# EAGLE design giraffevolvo (EAGLE 9.5.0)
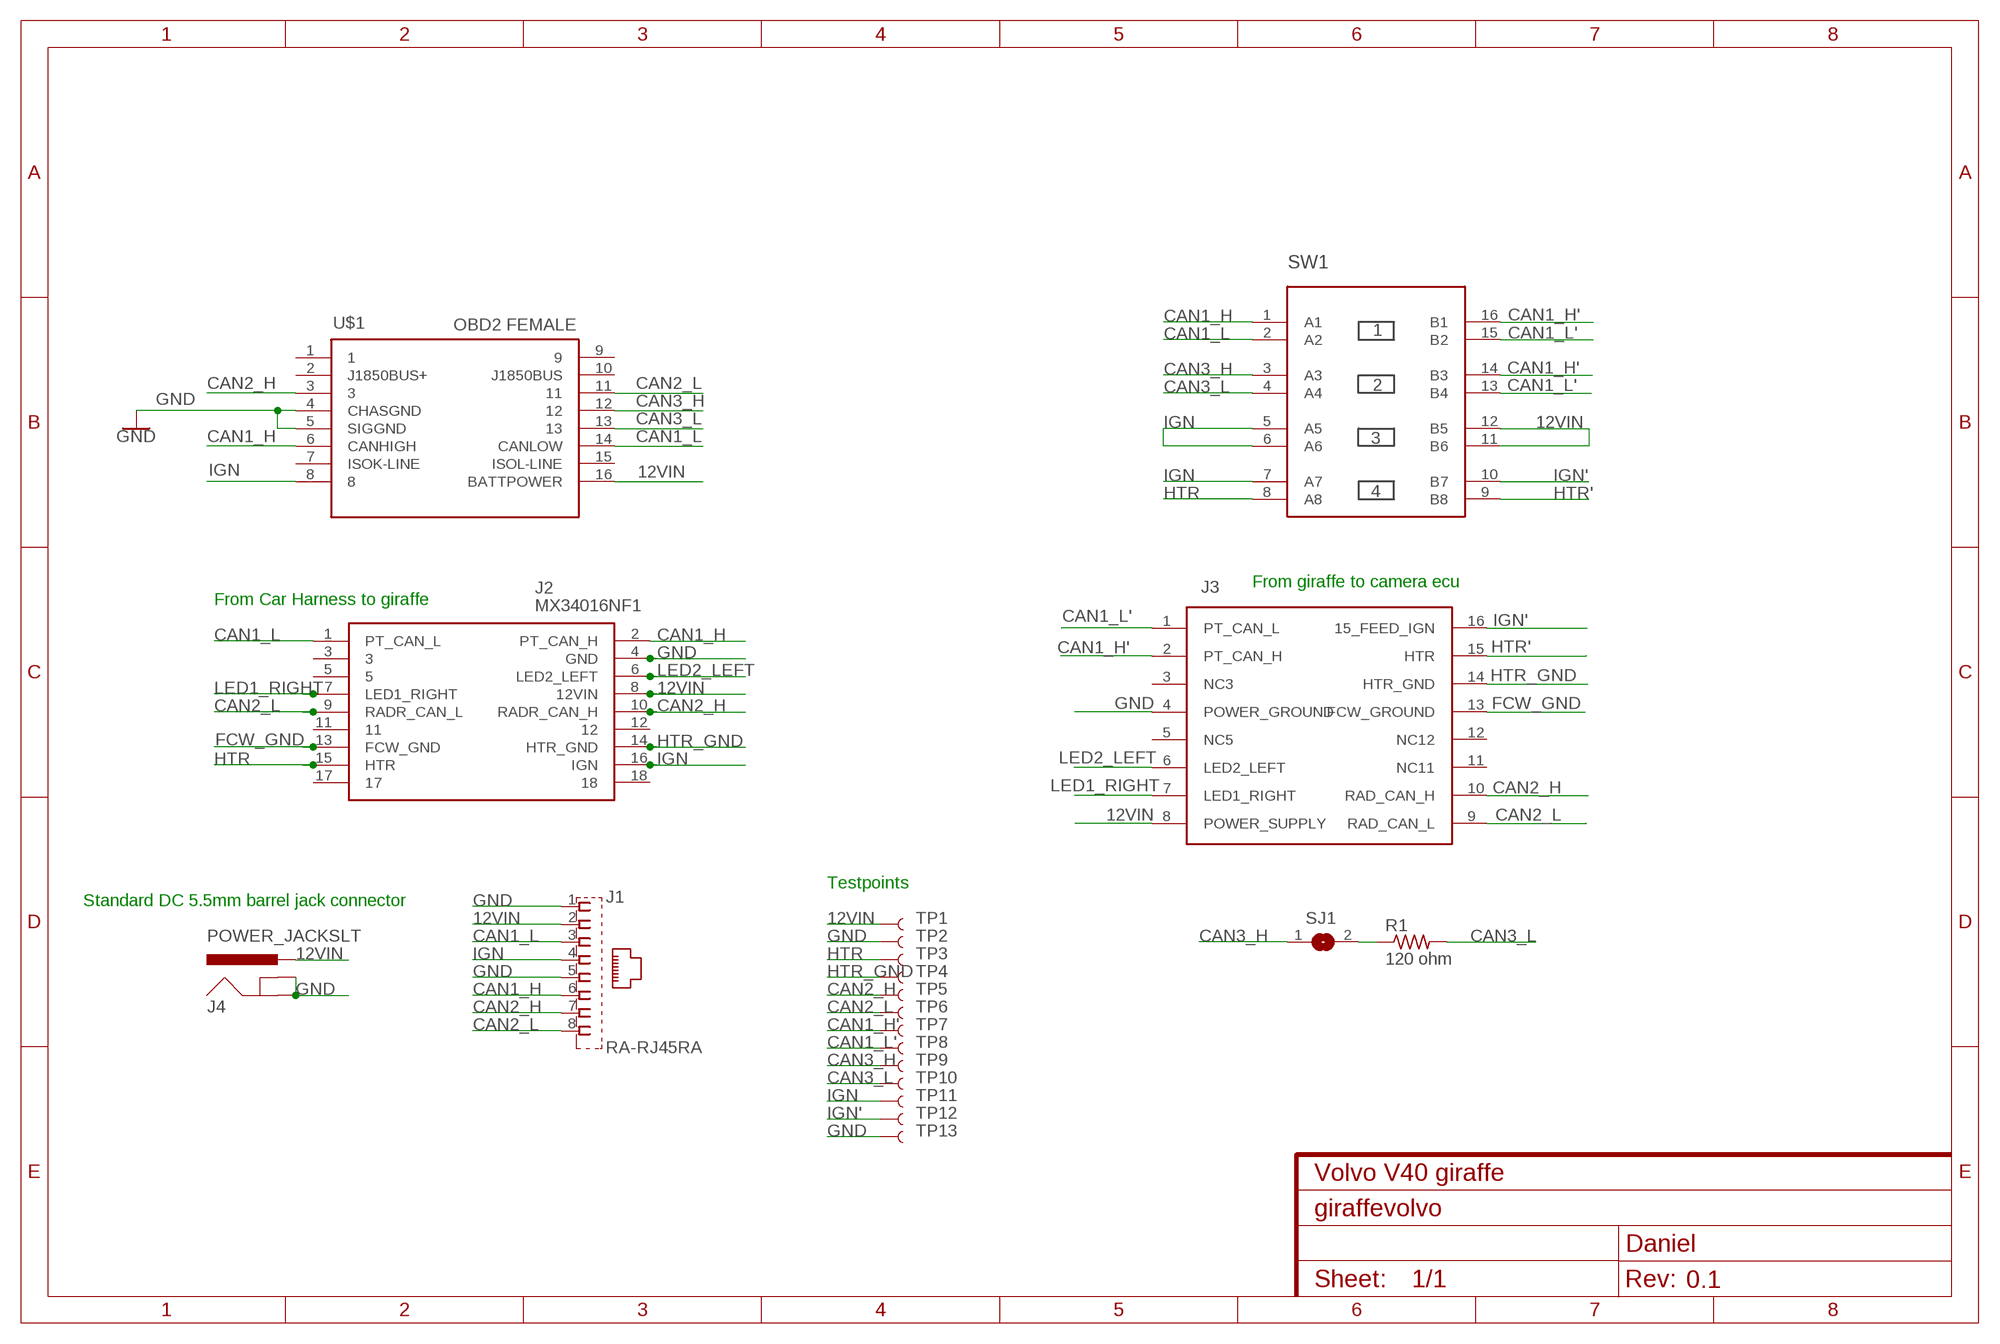
[diagram p0: schematic, sheet 1]
FRAME1 (FRAME-A4L): CNAME: Volvo V40 giraffe; CREVISION: 0.1; DESIGNER: Daniel

## Parts
J1  RA-RJ45RA  [RA-RJ45]
J2  MX34016NF1  [MX34016NF1]
J3  MX34016SF1  [MX34016SF1]
J4  POWER_JACKSLT  [POWER_JACK_SLOT]
R1  120 ohm  R0603  [0603-R]
SJ1  SJ  [SJ]
SW1  4XDPSTSMT  [4-DPST]
TP1  TEST-POINT2  [PAD.02X.02]
TP2  TEST-POINT2  [PAD.02X.02]
TP3  TEST-POINT2  [PAD.02X.02]
TP4  TEST-POINT2  [PAD.02X.02]
TP5  TEST-POINT2  [PAD.02X.02]
TP6  TEST-POINT2  [PAD.02X.02]
TP7  TEST-POINT2  [PAD.02X.02]
TP8  TEST-POINT2  [PAD.02X.02]
TP9  TEST-POINT2  [PAD.02X.02]
TP10  TEST-POINT2  [PAD.02X.02]
TP11  TEST-POINT2  [PAD.02X.02]
TP12  TEST-POINT2  [PAD.02X.02]
TP13  TEST-POINT2  [PAD.02X.02]
U$1  OBDIIFEMALE  [OBDII-FEMALE]

## Nets
12VIN: J1.2 J2.8(12VIN) J3.8(POWER_SUPPLY) J4.PWR SW1.11(B6) SW1.12(B5) TP1.P$1 U$1.16(BATTPOWER)
CAN1_H [can]: J1.6 J2.2(PT_CAN_H) SW1.1(A1) U$1.6(CANHIGH)
CAN1_H' [can]: J3.2(PT_CAN_H) SW1.14(B3) SW1.16(B1) TP7.P$1
CAN1_L [can]: J1.3 J2.1(PT_CAN_L) SW1.2(A2) U$1.14(CANLOW)
CAN1_L' [can]: J3.1(PT_CAN_L) SW1.13(B4) SW1.15(B2) TP8.P$1
CAN2_H [can]: J1.7 J2.10(RADR_CAN_H) J3.10(RAD_CAN_H) TP5.P$1 U$1.3
CAN2_L [can]: J1.8 J2.9(RADR_CAN_L) J3.9(RAD_CAN_L) TP6.P$1 U$1.11
CAN3_H [can]: SJ1.1 SW1.3(A3) TP9.P$1 U$1.12
CAN3_L [can]: R1.2 SW1.4(A4) TP10.P$1 U$1.13
FCW_GND [led]: J2.13(FCW_GND) J3.13(FCW_GROUND)
GND: J1.1 J1.5 J2.4(GND) J3.4(POWER_GROUND) J4.GND@1(GNDBREAK) J4.GND@2(GND) TP2.P$1 TP13.P$1 U$1.4(CHASGND) U$1.5(SIGGND)
HTR: J2.15(HTR) SW1.8(A8) TP3.P$1
HTR': J3.15(HTR) SW1.9(B8)
HTR_GND [led]: J2.14(HTR_GND) J3.14(HTR_GND) TP4.P$1
IGN [can]: J1.4 J2.16(IGN) SW1.5(A5) SW1.6(A6) SW1.7(A7) TP11.P$1 U$1.8
IGN' [can]: J3.16(15_FEED_IGN) SW1.10(B7) TP12.P$1
LED1_RIGHT [led]: J2.7(LED1_RIGHT) J3.7(LED1_RIGHT)
LED2_LEFT [led]: J2.6(LED2_LEFT) J3.6(LED2_LEFT)
N$1 [can]: R1.1 SJ1.2
Unconnected: J2.3 J2.5 J2.11 J2.12 J2.17 J2.18 J3.3(NC3) J3.5(NC5) J3.11(NC11) J3.12(NC12) U$1.1 U$1.2(J1850BUS+) U$1.7(ISOK-LINE) U$1.9 U$1.10(J1850BUS) U$1.15(ISOL-LINE)

## Notes on the sheet
- From giraffe to camera ecu
- From Car Harness to giraffe
- Testpoints
- Standard DC 5.5mm barrel jack connector

## Library data of the parts
J1 = comma.ai:RA-RJ45
J2 = MX34016NF1:MX34016NF1: JAE MX34 Series, 2.2mm Pitch 16 Way 2 Row Right Angle PCB Header, Solder Termination, 3A Source: Datasheet <https://componentsearchengine.com/Datasheets/1/MX34016NF1.pdf>; DESCRIPTION: JAE MX34 Series, 2.2mm Pitch 16 Way 2 Row Right Angle PCB Header, Solder Termination, 3A; HEIGHT: 16mm; MANUFACTURER_NAME: JAE Electronics; MANUFACTURER_PART_NUMBER: MX34016NF1; MOUSER_PART_NUMBER: 656-MX34016NF1; MOUSER_PRICE-STOCK: https://www.mouser.com/Search/Refine.aspx?Keyword=656-MX34016NF1
J3 = MX34016SF1:MX34016SF1: 16-pin female autmotive connector.
J4 = SparkFun-Connectors:POWER_JACK: Power Jack Connector This is the standard 5.5mm barrel jack for power. The PTH is the most common, proven, reliable, footprint. The Slot footprint only works if the mill layer is transmitted to the PCB fab house so be warned. Here are the connectors we sell at SparkFun: DC Barrel Power Jack/Connector <https://www.sparkfun.com/products/119> (PRT-00119) DC Barrel Power Jack/Connector (SMD) <https://www.sparkfun.com/products/12748> (PRT-12748) DC Barrel Jack Adapter - Breadboard Compatible <https://www.sparkfun.com/products/10811> (PRT-10811) It is used on this SparkFun product (and many, many others): SparkFun RedBoard - Programmed with Arduino <https://www.sparkfun.com/products/12757> (DEV-12757) Also, if you need a mating power supply or connector, please check these out: Wall Adapter Power Supply - 9VDC 650mA <https://www.sparkfun.com/products/298> (TOL-00298) DC Barrel Jack Adapter - Male <https://www.sparkfun.com/products/10287> (PRT-10287); PROD_ID: PRT-00119
R1 = comma.ai:R
SJ1 = jumper:SJ: SMD solder JUMPER
SW1 = comma.ai:4XDPST
TP1-TP13 = SparkFun-Connectors:TEST-POINT: SparkFun Test Points Bare copper test points for troubleshooting or In-Circuit-Testing. These are used by our Production team for verifying production board runs using pogo-pins on test beds. SparkFun Products: SparkFun LSM9DS1 Breakout <https://www.sparkfun.com/products/13284> SparkFun PSOC <https://www.sparkfun.com/products/13714> SparkFun Load Cell Amplifier <https://www.sparkfun.com/products/13879>
U$1 = comma.ai:OBDII: OBDII connector footprint; TEXT: OBD2 FEMALE

## Net classes
0 pwr: width 2 mm, drill 0.6 mm, clearance 0.2 mm
1 can: width 0.3 mm, drill 0.3 mm, clearance 0.16 mm
2 led: width 0.6 mm, drill 0.3 mm, clearance 0.2 mm

## Board
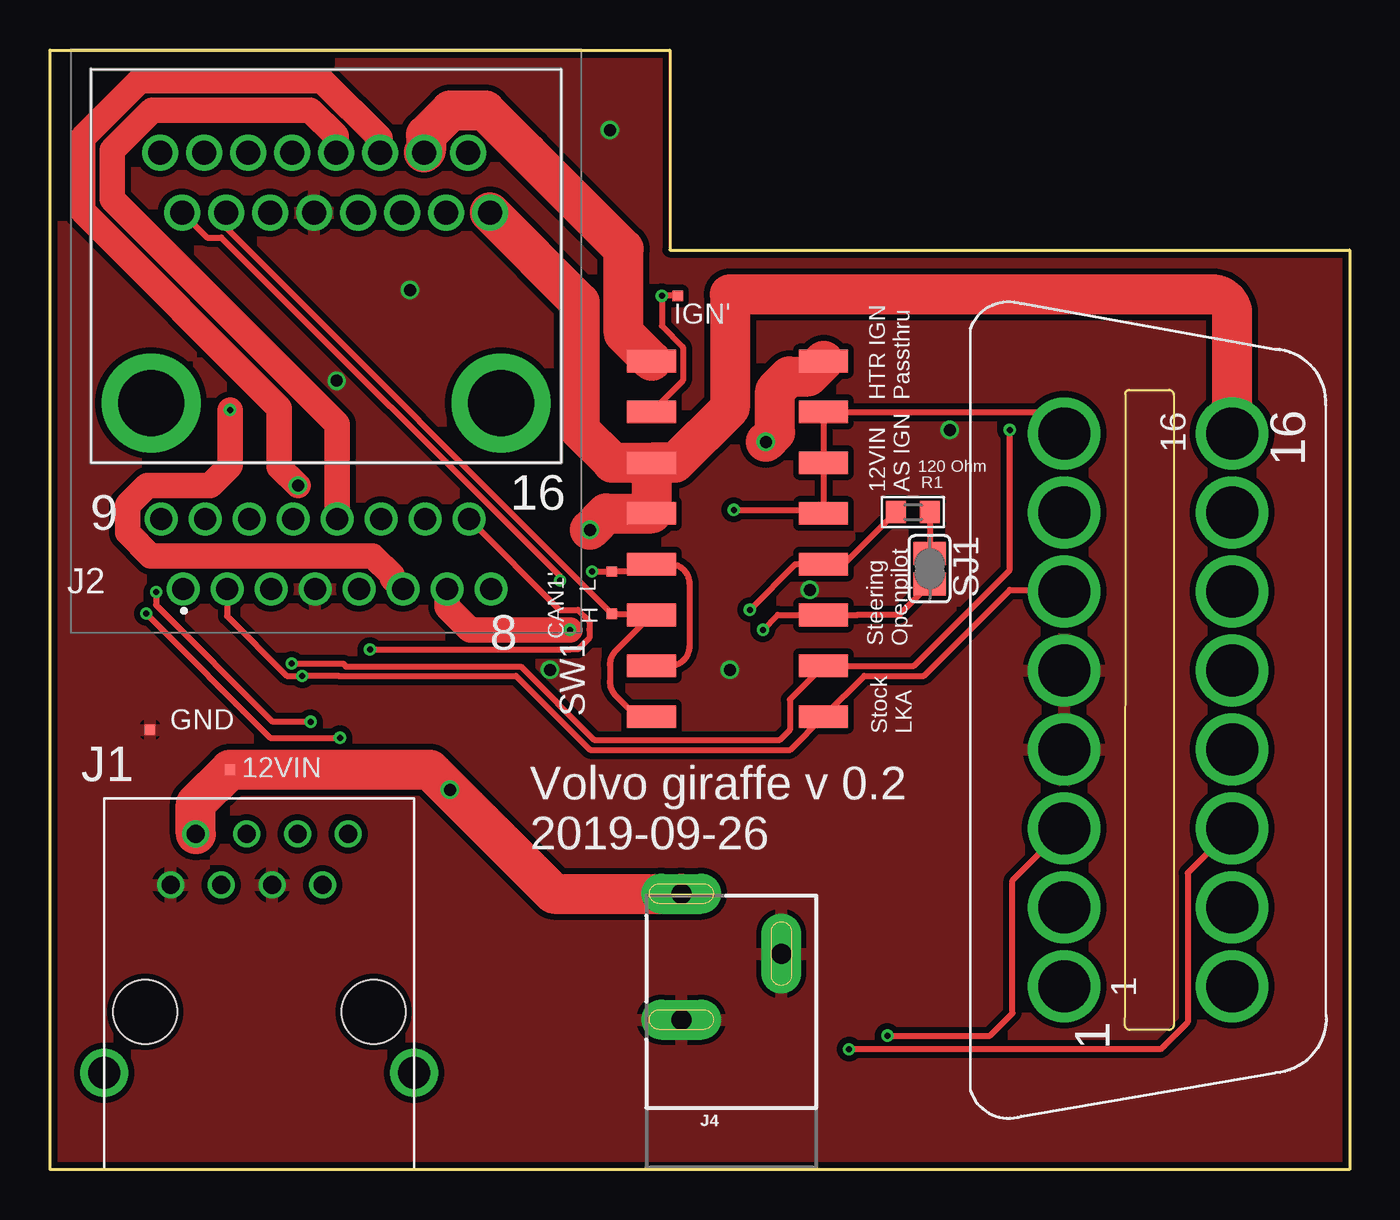
[diagram p1: board, top side]
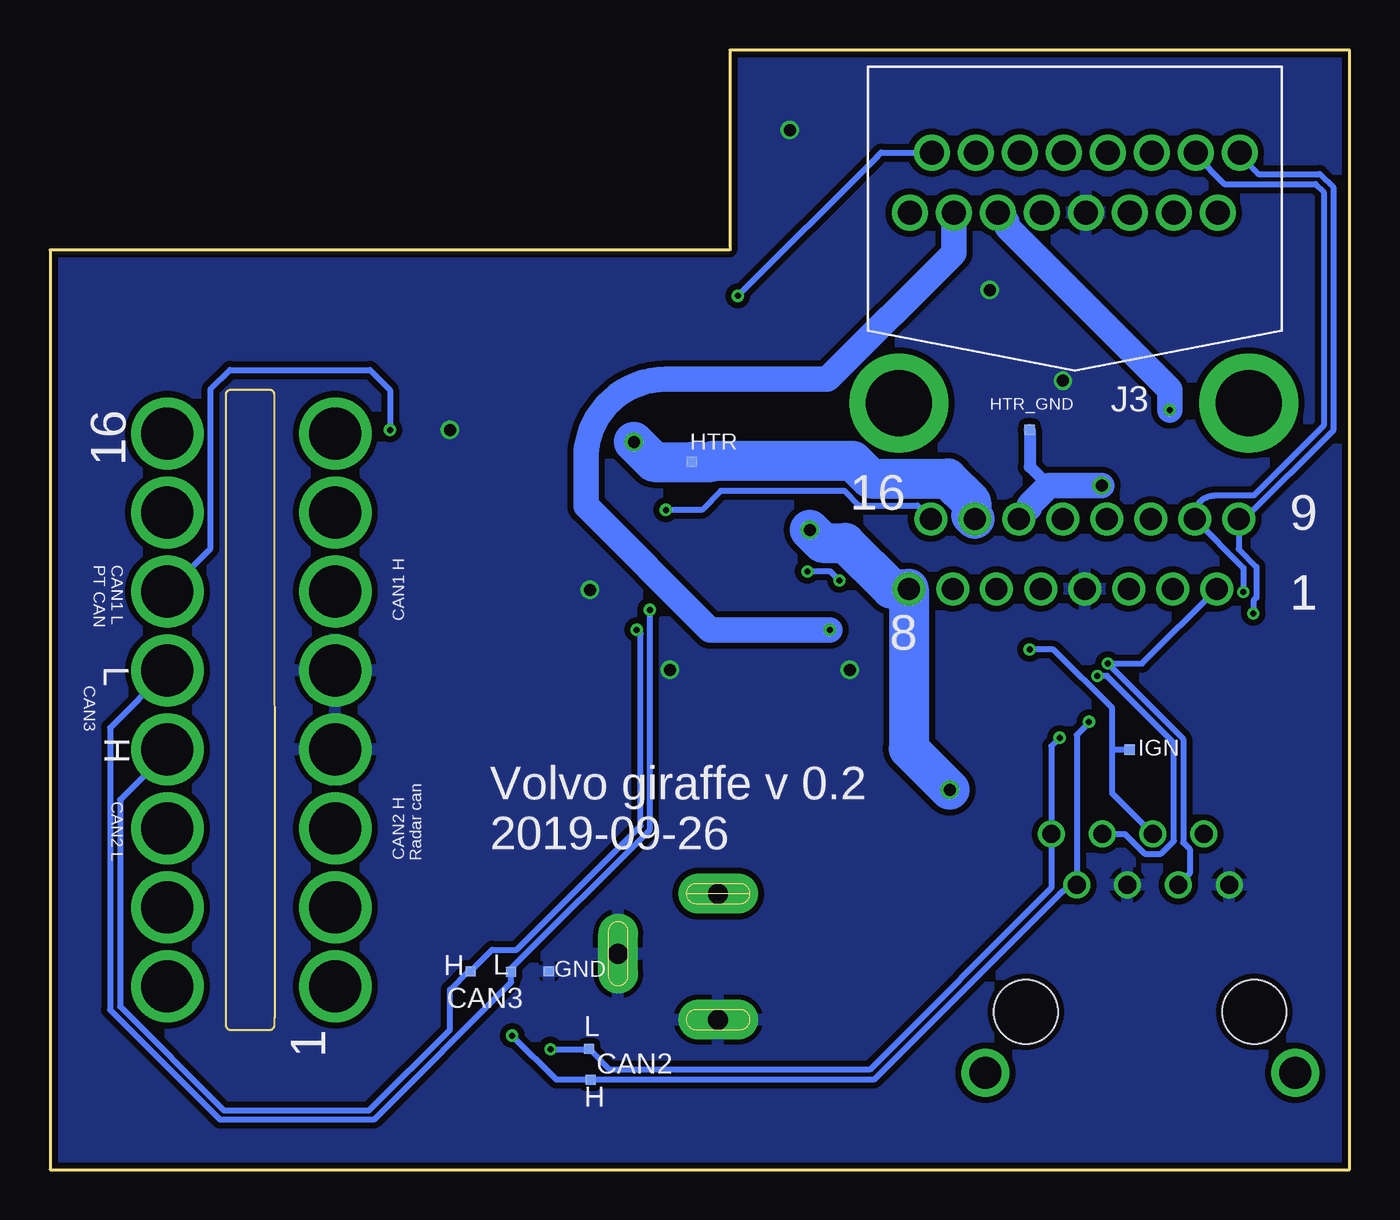
[diagram p2: board, bottom side, seen from below]

Size 65 x 56 mm. Coordinates in mm from the lower left corner, seen from the top.
Outline: 0,0 0,56 31,56 31,46 65,46 65,0 0,0
Copper layers (1*16): Top 0.035mm / dielectric 1.5mm / Bottom 0.035mm
Design rules "SparkFun-2-layer-PCBWay-LIMIT": minimum track width 6mil, minimum drill 0.3mm, track to track 6mil, track to pad 6mil, pad to pad 6mil, via to via 6mil, smd to smd 6mil, copper to edge 6mil, drill to drill 6mil, minimum pad ring 6mil, minimum via ring 6mil, stop-mask expansion 4mil, vias tented up to drill 25mil, thermal gap 10mil
Milling: 10 lines

### Footprints (pad centres in the part's own frame; a part is rotated, then mirrored left to right if it is on the bottom)
RA-RJ45 = drill 0.9: 1 -4.445,6.35; 2 -3.175,8.89; 3 -1.905,6.35; 4 -0.635,8.89; 5 0.635,6.35; 6 1.905,8.89; 7 3.175,6.35; 8 4.445,8.89 | drill 1.6: P$1 -7.75,-3.05; P$2 7.75,-3.05 | hole 3.2: -5.715,0; 5.715,0
MX34016NF1 = drill 1.1 pad 1.65: 1 7.15,12.4; 2 4.95,12.4; 3 2.75,12.4; 4 0.55,12.4; 5 -1.65,12.4; 6 -3.85,12.4; 7 -6.05,12.4; 8 -8.25,12.4; 9 8.25,8.9; 10 6.05,8.9; 11 3.85,8.9; 12 1.65,8.9; 13 -0.55,8.9; 14 -2.75,8.9; 15 -4.95,8.9; 16 -7.15,8.9 | drill 3.3 pad 4.95: 17 -8.75,3.1; 18 8.75,3.1
MX34016SF1 = drill 1.2: 1 -7.15,6.1; 2 -4.95,6.1; 3 -2.75,6.1; 4 -0.55,6.1; 5 1.65,6.1; 6 3.85,6.1; 7 6.05,6.1; 8 8.25,6.1; 9 -8.25,3.1; 10 -6.05,3.1; 11 -3.85,3.1; 12 -1.65,3.1; 13 0.55,3.1; 14 2.75,3.1; 15 4.95,3.1; 16 7.15,3.1
POWER_JACK_SLOT = drill 1 pad 2 long: GND@1 2.58,7.5; GND@2 7.58,10.8; PWR 2.58,13.8
0603-R = smd 1 x 1.1: 1 -0.85,0; 2 0.85,0
SJ = smd 1.168 x 1.6: 1 -0.762,0; 2 0.762,0
4-DPST = smd 1.13 x 2.44: 1 -8.89,-4.3; 2 -6.35,-4.3; 3 -3.81,-4.3; 4 -1.27,-4.3; 5 1.27,-4.3; 6 3.81,-4.3; 7 6.35,-4.3; 8 8.89,-4.3; 9 8.89,4.3; 10 6.35,4.3; 11 3.81,4.3; 12 1.27,4.3; 13 -1.27,4.3; 14 -3.81,4.3; 15 -6.35,4.3; 16 -8.89,4.3
PAD.02X.02 = smd 0.508 x 0.508: P$1 0,0
OBDII-FEMALE = drill 2.6 pad 3.4: 1 13.825,-4.2; 2 9.875,-4.2; 3 5.925,-4.2; 4 1.975,-4.2; 5 -1.975,-4.2; 6 -5.925,-4.2; 7 -9.875,-4.2; 8 -13.825,-4.2; 9 13.825,4.2; 10 9.875,4.2; 11 5.925,4.2; 12 1.975,4.2; 13 -1.975,4.2; 14 -5.925,4.2; 15 -9.875,4.2; 16 -13.825,4.2

### Placement (x,y rotation side)
J1  10.47,7.89 0 top
J2  13.8,41.44 180 top
J3  13.75,53.97 180 bottom
J4  29,0 0 top
R1  43.17,32.88 180 top
SJ1  44,30.05 90 top
SW1  34.39,31.55 90 top
TP1  9,20 0 top
TP2  40.05,9.91 0 bottom
TP3  32.9,35.4 0 bottom
TP4  16,37 0 bottom
TP5  37.97,4.49 0 bottom
TP6  38.04,6.03 0 bottom
TP7  28.1,27.8 0 top
TP8  28.1,29.91 0 top
TP9  43.96,9.92 0 bottom
TP10  41.93,9.88 0 bottom
TP11  11,21 0 bottom
TP12  31.4,43.7 0 top
TP13  5,22 0 top
U$1  54.93,22.99 270 top

### Tracks (layer width: path | path; a pad name or v marks a point on that pad's centre or on a via)
12VIN  (via drill 0.6)
  Top 2: SW1.11 28.14,35.36 26.5,37 26.5,43.38 J3.8 | SW1.11 31.26,35.36 34,38.1 34,43.77 58.13,43.77 arc-90 59.13,42.77 U$1.16 | J1.2 7.29,18.3 TP1.P$1 19,20 v20,19 25.2,13.8 J4.PWR | SW1.11 SW1.12 27.82,32.82 v27,32
  Bottom 2: v27,32 26.35,31.35 25.23,31.35 22.91,29.04 J2.8 22.05,21.05 v20,19
CAN1_H  (via drill 0.3)
  Top 0.3: U$1.6 50.65,29 48,29 43.7,24.7 40.73,24.7 SW1.1 37.03,21 27,21 23.3,24.7 14.42,24.7 14.41,24.69 v12.62,24.69 11.84,24.69 8.85,27.68 J2.2
  Bottom 0.3: J1.6 11.23,16.78 10.24,15.79 9.43,15.79 8.78,16.44 8.78,21.34 12.13,24.69 v12.62,24.69
CAN1_H'
  Top 0.3: J3.2 8.8,47.1 TP7.P$1 30.03,27.8 SW1.14 28.29,25.94 arc45 28,25.24 28,24.41 arc45 28.29,23.71 29.05,22.95 arc45 29.75,22.66 SW1.16
CAN1_L  (via drill 0.3)
  Top 0.3: v48,37 48,30 43.2,25.2 SW1.2 37,23.51 37,22 36.5,21.5 27.22,21.5 23.56,25.16 14.81,25.16 14.66,25.3 v12.1,25.3
  Bottom 0.3: U$1.14 56.97,31.07 56.97,39.03 56,40 49,40 48,39 v48,37 | J1.3 8,14.8 8,16.04 8.32,16.36 8.32,21.53 v12.1,25.3 10.39,25.3 J2.1
CAN1_L'  (via drill 0.3)
  Top 0.3: J3.1 7.85,46.62 8.57,46.62 25.51,29.68 v25.51,29.46 | SW1.15 31,25.2 arc90 32,26.2 32,29.28 arc90 31,30.28 SW1.13 29.72,29.91 TP8.P$1 27.14,29.9 v27.12,29.92
  Bottom 0.3: v25.51,29.46 25.97,29.92 v27.12,29.92
CAN2_H  (via drill 0.3)
  Top 0.3: v5.3,28.88 5.3,28.24 11.15,22.4 v13.03,22.4 | v41.88,6.7 47.02,6.7 48.14,7.82 48.14,14.47 U$1.3
  Bottom 0.3: v13.03,22.4 13.03,22.35 13.64,21.73 J1.7 13.8,14.08 arc45 14,14 arc-45 14.5,13.79 23.79,4.5 TP5.P$1 39.67,4.49 v41.88,6.7 | v5.3,28.88 5.3,30.09 J2.10 7.75,32.72 arc90 6.75,33.72 4.79,33.72 1.3,37.21 1.3,48.89 1.71,49.3 6.27,49.3 7.7,50.73 J3.10
CAN2_L  (via drill 0.3)
  Top 0.3: v4.81,27.81 11.03,21.6 v14.5,21.6 | U$1.11 56.9,14.84 56.9,7.37 55.55,6.02 v39.97,6.02
  Bottom 0.3: v14.5,21.6 14.91,21.18 J1.8 14.91,14.09 24,5 37.01,5 TP6.P$1 v39.97,6.02 | J3.9 5.5,50.73 4.57,49.8 1.5,49.8 0.8,49.1 0.8,37 5.26,32.54 J2.9 5.55,31.05 4.65,30.15 4.65,28.61 4.81,28.45 v4.81,27.81
CAN3_H  (via drill 0.3)
  Top 0.3: v35.65,27 36.39,27.74 SW1.3 40.4,27.74 42.45,27.74 SJ1.1
  Bottom 0.3: U$1.12 59.13,20.87 61.5,18.5 61.5,8.15 56.31,2.96 49.04,2.96 45,7 45,9 44.08,9.92 TP9.P$1 42.88,11 41.65,11 35.46,17.19 35.46,26.81 v35.65,27
CAN3_L  (via drill 0.3)
  Top 0.3: v35,28 37.28,30.28 SW1.4 39.72,30.28 R1.2
  Bottom 0.3: U$1.13 62,22.09 62,8 56.5,2.5 48.79,2.5 41.93,9.36 TP10.P$1 41.93,10.07 35,17 v35,28
FCW_GND
  Top 1.27: J2.13 14.35,37.28 3.1,48.53 3.1,51 5.1,53 13,53 14.3,51.7 J3.13
GND  (via drill 0.6)
  other vias: 28,52 18,44 14.34,39.45 45,37 34,25 25,25 38,29
  pour Bottom (isolate 0.305): -2,59 -2,-2 67,-2 67,59
  pour Top (isolate 0.305): -1.98,57 -1.98,-1 66,-1 66,57
HTR  (via drill 0.6)
  Top 2: v35.8,36.4 36.27,36.87 36.27,38.96 36.97,39.66 37.91,39.66 SW1.8
  Bottom 2: v35.8,36.4 34.8,35.4 TP3.P$1 31.91,35.4 31.86,35.45 24.86,35.45 23.97,34.56 20.11,34.56 18.93,33.38 18.93,32.72 J2.15
HTR'
  Top 2: SW1.9 28.7,41.84 28.7,46.05 23.87,50.87 21.77,52.97 20.03,52.97 18.8,51.74 18.8,50.97 J3.15
HTR_GND  (via drill 0.6)
  Top 1.27: v12.4,34.21 11.47,35.14 11.47,38.09 1.63,47.93 1.63,51.61 4.49,54.47 13.61,54.47 16.5,51.58 J3.14
  Bottom 0.6: TP4.P$1 16,35.16 15.04,34.2
  Bottom 1.27: v12.4,34.21 v12.41,34.2 15.04,34.2 16.01,33.23 16.01,33.08 J2.14
IGN  (via drill 0.3)
  Top 0.3: SW1.5 38.69,33 SW1.6 SW1.7 49.73,37.9 arc-90 50.73,36.9 U$1.8 | J2.16 25.49,28 26.39,28 26.98,27.41 26.98,27.02 27,27 26.98,26.98 26.98,26.59 26.41,26.02 26.02,26.02 26,26 16.01,26 v16,26.01
  Top 0.305: v34.2,33 38.69,33
  Bottom 0.3: v34.2,33 32.4,33 31.45,33.95 25.27,33.95 24.53,33.22 21.62,33.22 J2.16 | J1.4 11.88,18.82 11.88,21 | 11.88,21 11.88,23.08 14.81,26.01 v16,26.01 | TP11.P$1 11.88,21
IGN'  (via drill 0.3)
  Top 0.3: SW1.10 31.66,39.47 31.66,41.15 30.6,42.21 v30.6,43.7 TP12.P$1
  Bottom 0.3: v30.6,43.7 23.65,50.65 23.56,50.74 23.43,50.87 J3.16
LED1_RIGHT  (via drill 0.3)
  Top 1.27: v26,27 21,27 19.85,28.15 J2.7
  Bottom 1.27: J3.7 19.8,45.85 26.11,39.54 34.2,39.54 arc-90 38.2,35.54 38.2,33.2 32,27 v26,27
LED2_LEFT  (via drill 0.3)
  Top 1.27: J2.6 17.11,29.58 17.11,29.73 16.14,30.7 5.04,30.7 3.89,31.85 3.89,33.23 4.86,34.2 8,34.2 9,35.2 v9,38
  Bottom 1.27: J3.6 17.14,47.41 17.14,47.15 9,39.02 v9,38
N$1
  Top 0.3: R1.1 44.02,30.83 SJ1.2

### Text on the board
tNames: IGN' | HTR IGN / Passthru | 16 | 120 Ohm | 12VIN / AS IGN | 16 | 9 | L | CAN1' | H | 8 | Steering / Openpilot | GND | Stock / LKA | 12VIN | Volvo giraffe v 0.2 / 2019-09-26 | 1
bNames: HTR_GND | 16 | HTR | 16 | 9 | CAN1 L | PT CAN | 1 | CAN1 H | 8 | L | CAN3 | IGN | H | CAN2 L | Volvo giraffe v 0.2 / 2019-09-26 | Radar can | CAN2 H | GND | L | H | CAN3 | L | 1 | CAN2 | H